# Altium schematic sheet 14 segment.SchDoc
size A3
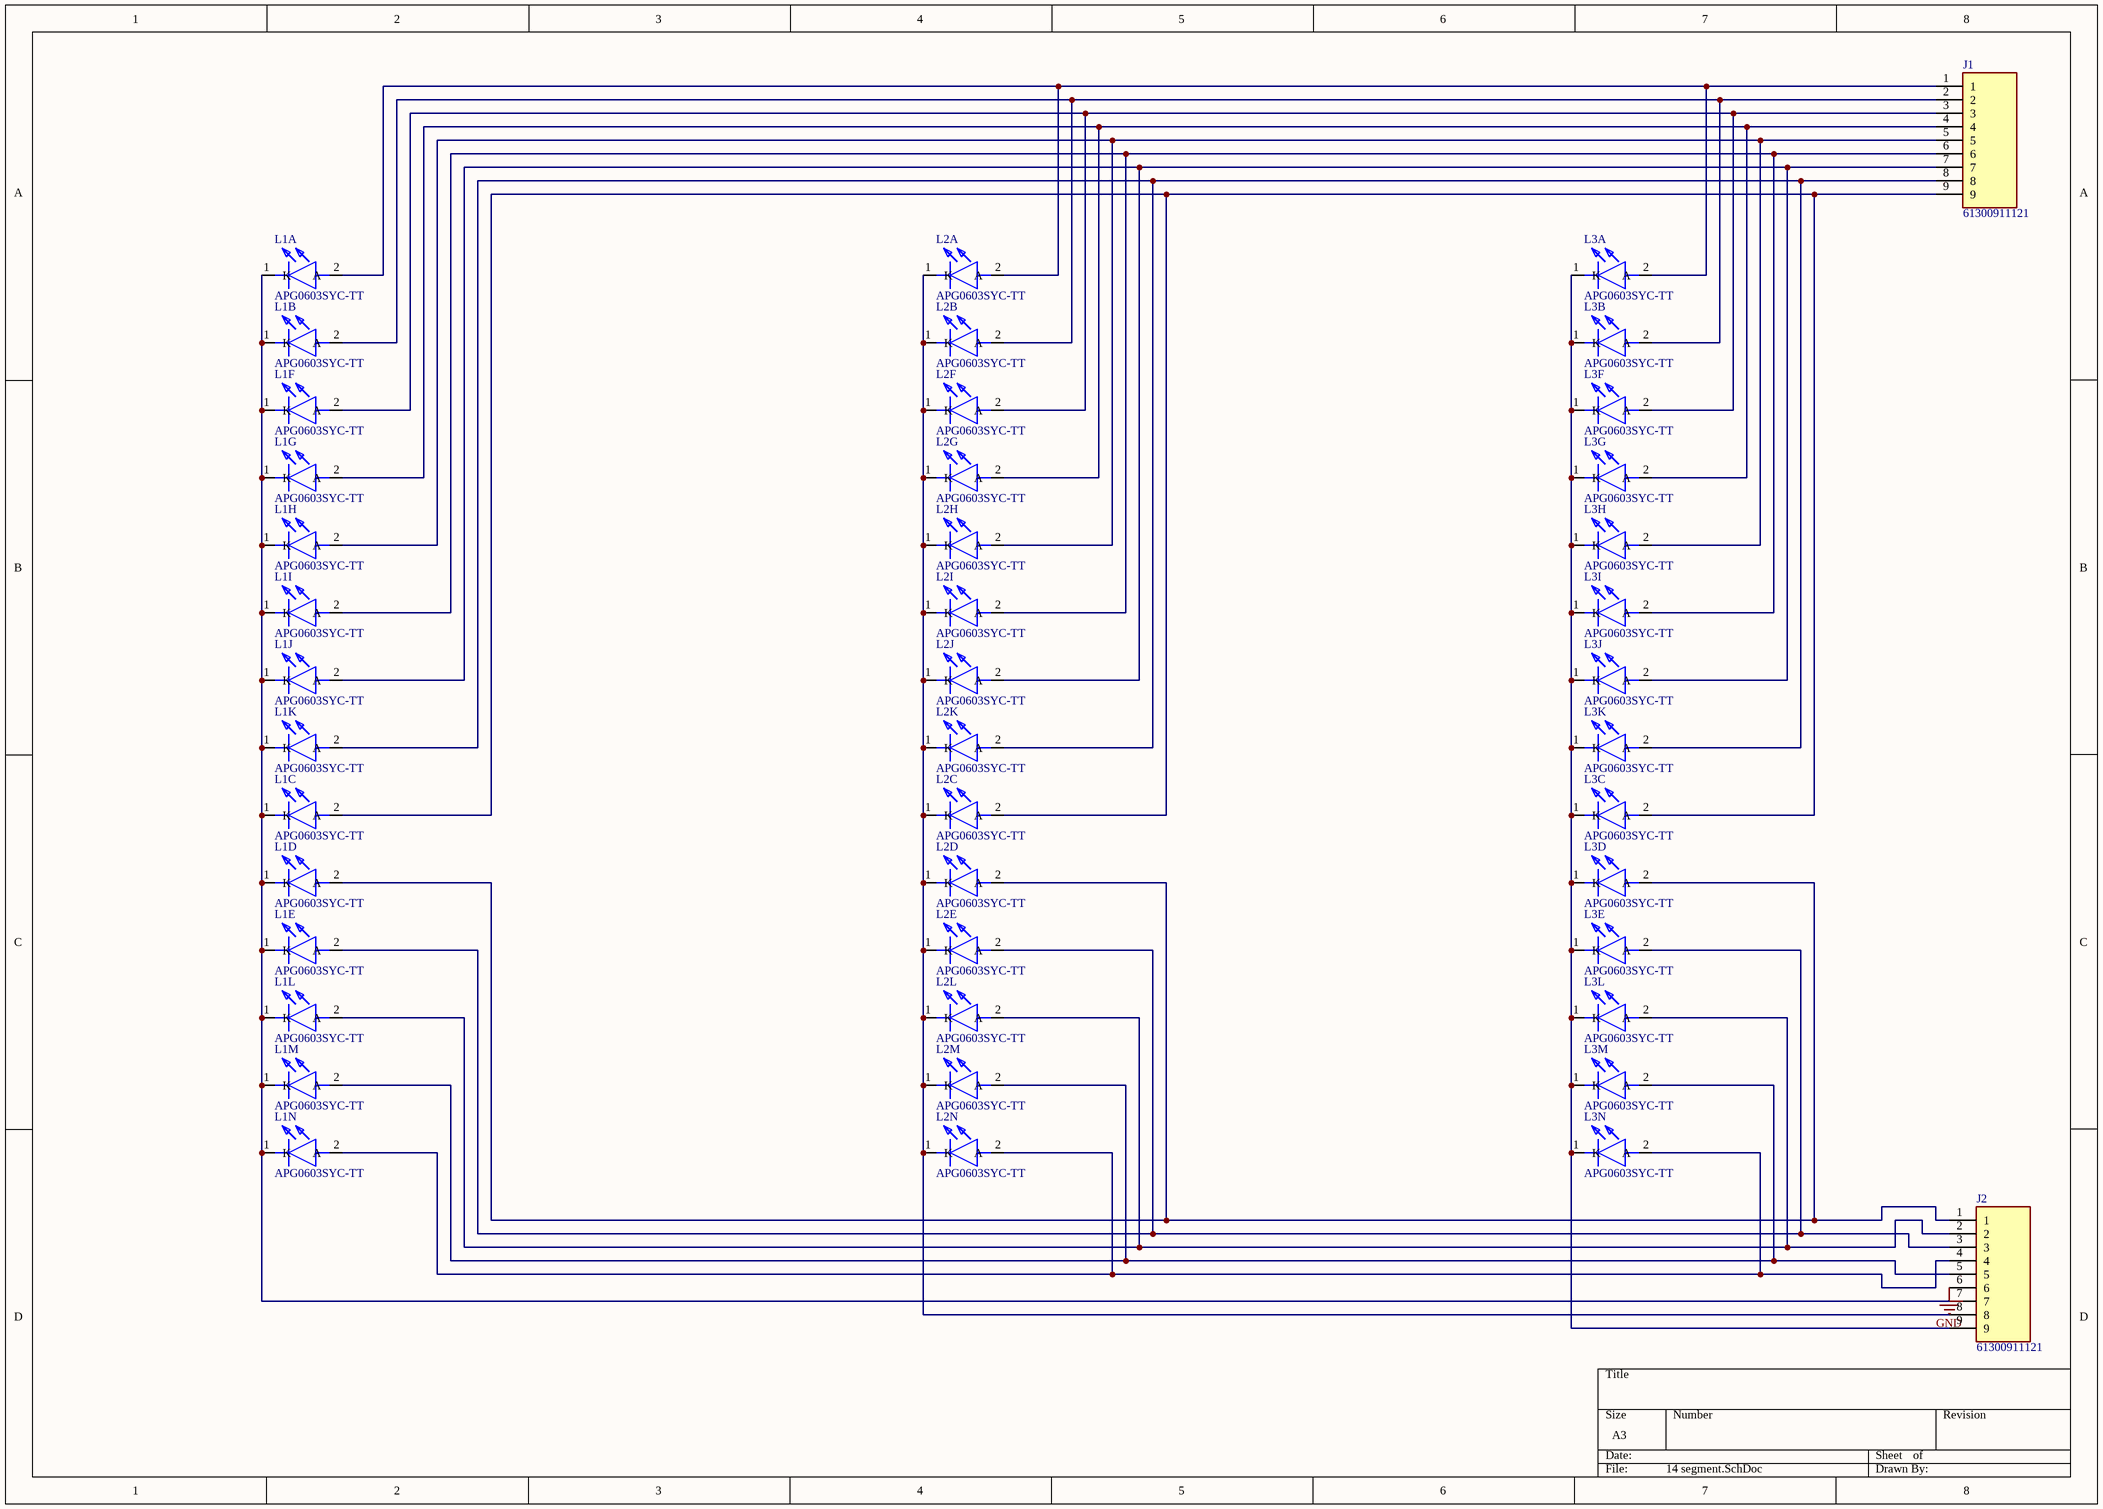
[diagram p0: 14 segment.SchDoc]

## Parts
J1  61300911121  [HDRV9W95P0X254_1X9_2286X254X874P]
J2  61300911121  [HDRV9W95P0X254_1X9_2286X254X874P]
L1A  APG0603SYC-TT  [APG0603SYCTT]
L1B  APG0603SYC-TT  [APG0603SYCTT]
L1C  APG0603SYC-TT  [APG0603SYCTT]
L1D  APG0603SYC-TT  [APG0603SYCTT]
L1E  APG0603SYC-TT  [APG0603SYCTT]
L1F  APG0603SYC-TT  [APG0603SYCTT]
L1G  APG0603SYC-TT  [APG0603SYCTT]
L1H  APG0603SYC-TT  [APG0603SYCTT]
L1I  APG0603SYC-TT  [APG0603SYCTT]
L1J  APG0603SYC-TT  [APG0603SYCTT]
L1K  APG0603SYC-TT  [APG0603SYCTT]
L1L  APG0603SYC-TT  [APG0603SYCTT]
L1M  APG0603SYC-TT  [APG0603SYCTT]
L1N  APG0603SYC-TT  [APG0603SYCTT]
L2A  APG0603SYC-TT  [APG0603SYCTT]
L2B  APG0603SYC-TT  [APG0603SYCTT]
L2C  APG0603SYC-TT  [APG0603SYCTT]
L2D  APG0603SYC-TT  [APG0603SYCTT]
L2E  APG0603SYC-TT  [APG0603SYCTT]
L2F  APG0603SYC-TT  [APG0603SYCTT]
L2G  APG0603SYC-TT  [APG0603SYCTT]
L2H  APG0603SYC-TT  [APG0603SYCTT]
L2I  APG0603SYC-TT  [APG0603SYCTT]
L2J  APG0603SYC-TT  [APG0603SYCTT]
L2K  APG0603SYC-TT  [APG0603SYCTT]
L2L  APG0603SYC-TT  [APG0603SYCTT]
L2M  APG0603SYC-TT  [APG0603SYCTT]
L2N  APG0603SYC-TT  [APG0603SYCTT]
L3A  APG0603SYC-TT  [APG0603SYCTT]
L3B  APG0603SYC-TT  [APG0603SYCTT]
L3C  APG0603SYC-TT  [APG0603SYCTT]
L3D  APG0603SYC-TT  [APG0603SYCTT]
L3E  APG0603SYC-TT  [APG0603SYCTT]
L3F  APG0603SYC-TT  [APG0603SYCTT]
L3G  APG0603SYC-TT  [APG0603SYCTT]
L3H  APG0603SYC-TT  [APG0603SYCTT]
L3I  APG0603SYC-TT  [APG0603SYCTT]
L3J  APG0603SYC-TT  [APG0603SYCTT]
L3K  APG0603SYC-TT  [APG0603SYCTT]
L3L  APG0603SYC-TT  [APG0603SYCTT]
L3M  APG0603SYC-TT  [APG0603SYCTT]
L3N  APG0603SYC-TT  [APG0603SYCTT]

## Nets
GND: J2.6
NetJ1_1: J1.1 L1A.2(A) L2A.2(A) L3A.2(A)
NetJ1_2: J1.2 L1B.2(A) L2B.2(A) L3B.2(A)
NetJ1_3: J1.3 L1F.2(A) L2F.2(A) L3F.2(A)
NetJ1_4: J1.4 L1G.2(A) L2G.2(A) L3G.2(A)
NetJ1_5: J1.5 L1H.2(A) L2H.2(A) L3H.2(A)
NetJ1_6: J1.6 L1I.2(A) L2I.2(A) L3I.2(A)
NetJ1_7: J1.7 L1J.2(A) L2J.2(A) L3J.2(A)
NetJ1_8: J1.8 L1K.2(A) L2K.2(A) L3K.2(A)
NetJ1_9: J1.9 L1C.2(A) L2C.2(A) L3C.2(A)
NetJ2_1: J2.1 L1D.2(A) L2D.2(A) L3D.2(A)
NetJ2_2: J2.2 L1L.2(A) L2L.2(A) L3L.2(A)
NetJ2_3: J2.3 L1E.2(A) L2E.2(A) L3E.2(A)
NetJ2_4: J2.4 L1N.2(A) L2N.2(A) L3N.2(A)
NetJ2_5: J2.5 L1M.2(A) L2M.2(A) L3M.2(A)
NetJ2_7: J2.7 L1A.1(K) L1B.1(K) L1C.1(K) L1D.1(K) L1E.1(K) L1F.1(K) L1G.1(K) L1H.1(K) L1I.1(K) L1J.1(K) L1K.1(K) L1L.1(K) L1M.1(K) L1N.1(K)
NetJ2_8: J2.8 L2A.1(K) L2B.1(K) L2C.1(K) L2D.1(K) L2E.1(K) L2F.1(K) L2G.1(K) L2H.1(K) L2I.1(K) L2J.1(K) L2K.1(K) L2L.1(K) L2M.1(K) L2N.1(K)
NetJ2_9: J2.9 L3A.1(K) L3B.1(K) L3C.1(K) L3D.1(K) L3E.1(K) L3F.1(K) L3G.1(K) L3H.1(K) L3I.1(K) L3J.1(K) L3K.1(K) L3L.1(K) L3M.1(K) L3N.1(K)

## Library data of the parts
J1 J2 = 61300911121: Connector; Manufacturer_Name: Wurth Elektronik; Datasheet Link: http://uk.rs-online.com/web/p/products/8281608; Height: 8.74mm; Manufacturer_Part_Number: 61300911121; Arrow Part Number: 61300911121; Mouser Part Number: 710-61300911121; Mouser Price/Stock: https://www.mouser.co.uk/ProductDetail/Wurth-Elektronik/61300911121?qs=PhR8RmCirEZgp0mLtcLaGw%3D%3D
L1A L1B L1C L1D L1E L1F L1G L1H L1I L1J L1K L1L L1M L1N L2A L2B L2C L2D L2E L2F L2G L2H L2I L2J L2K L2L L2M L2N L3A L3B L3C L3D L3E L3F L3G L3H L3I L3J L3K L3L L3M L3N = APG0603SYC-TT: LED; Manufacturer_Name: Kingbright; Datasheet Link: https://www.arrow.com/en/products/apg0603syc-tt/kingbright; Height: 0.25mm; Manufacturer_Part_Number: APG0603SYC-TT; Arrow Part Number: APG0603SYC-TT; Arrow Price/Stock: https://www.arrow.com/en/products/apg0603syc-tt/kingbright; Mouser Part Number: 604-APG0603SYCTT; Mouser Price/Stock: https://www.mouser.co.uk/ProductDetail/Kingbright/APG0603SYC-TT?qs=cRhdKgsiOJobAwdG3Dg3Tw%3D%3D